# Altium schematic sheet SCH15.SchDoc
size 381 x 241 mm; SheetNumber: 1; SheetTotal: 1
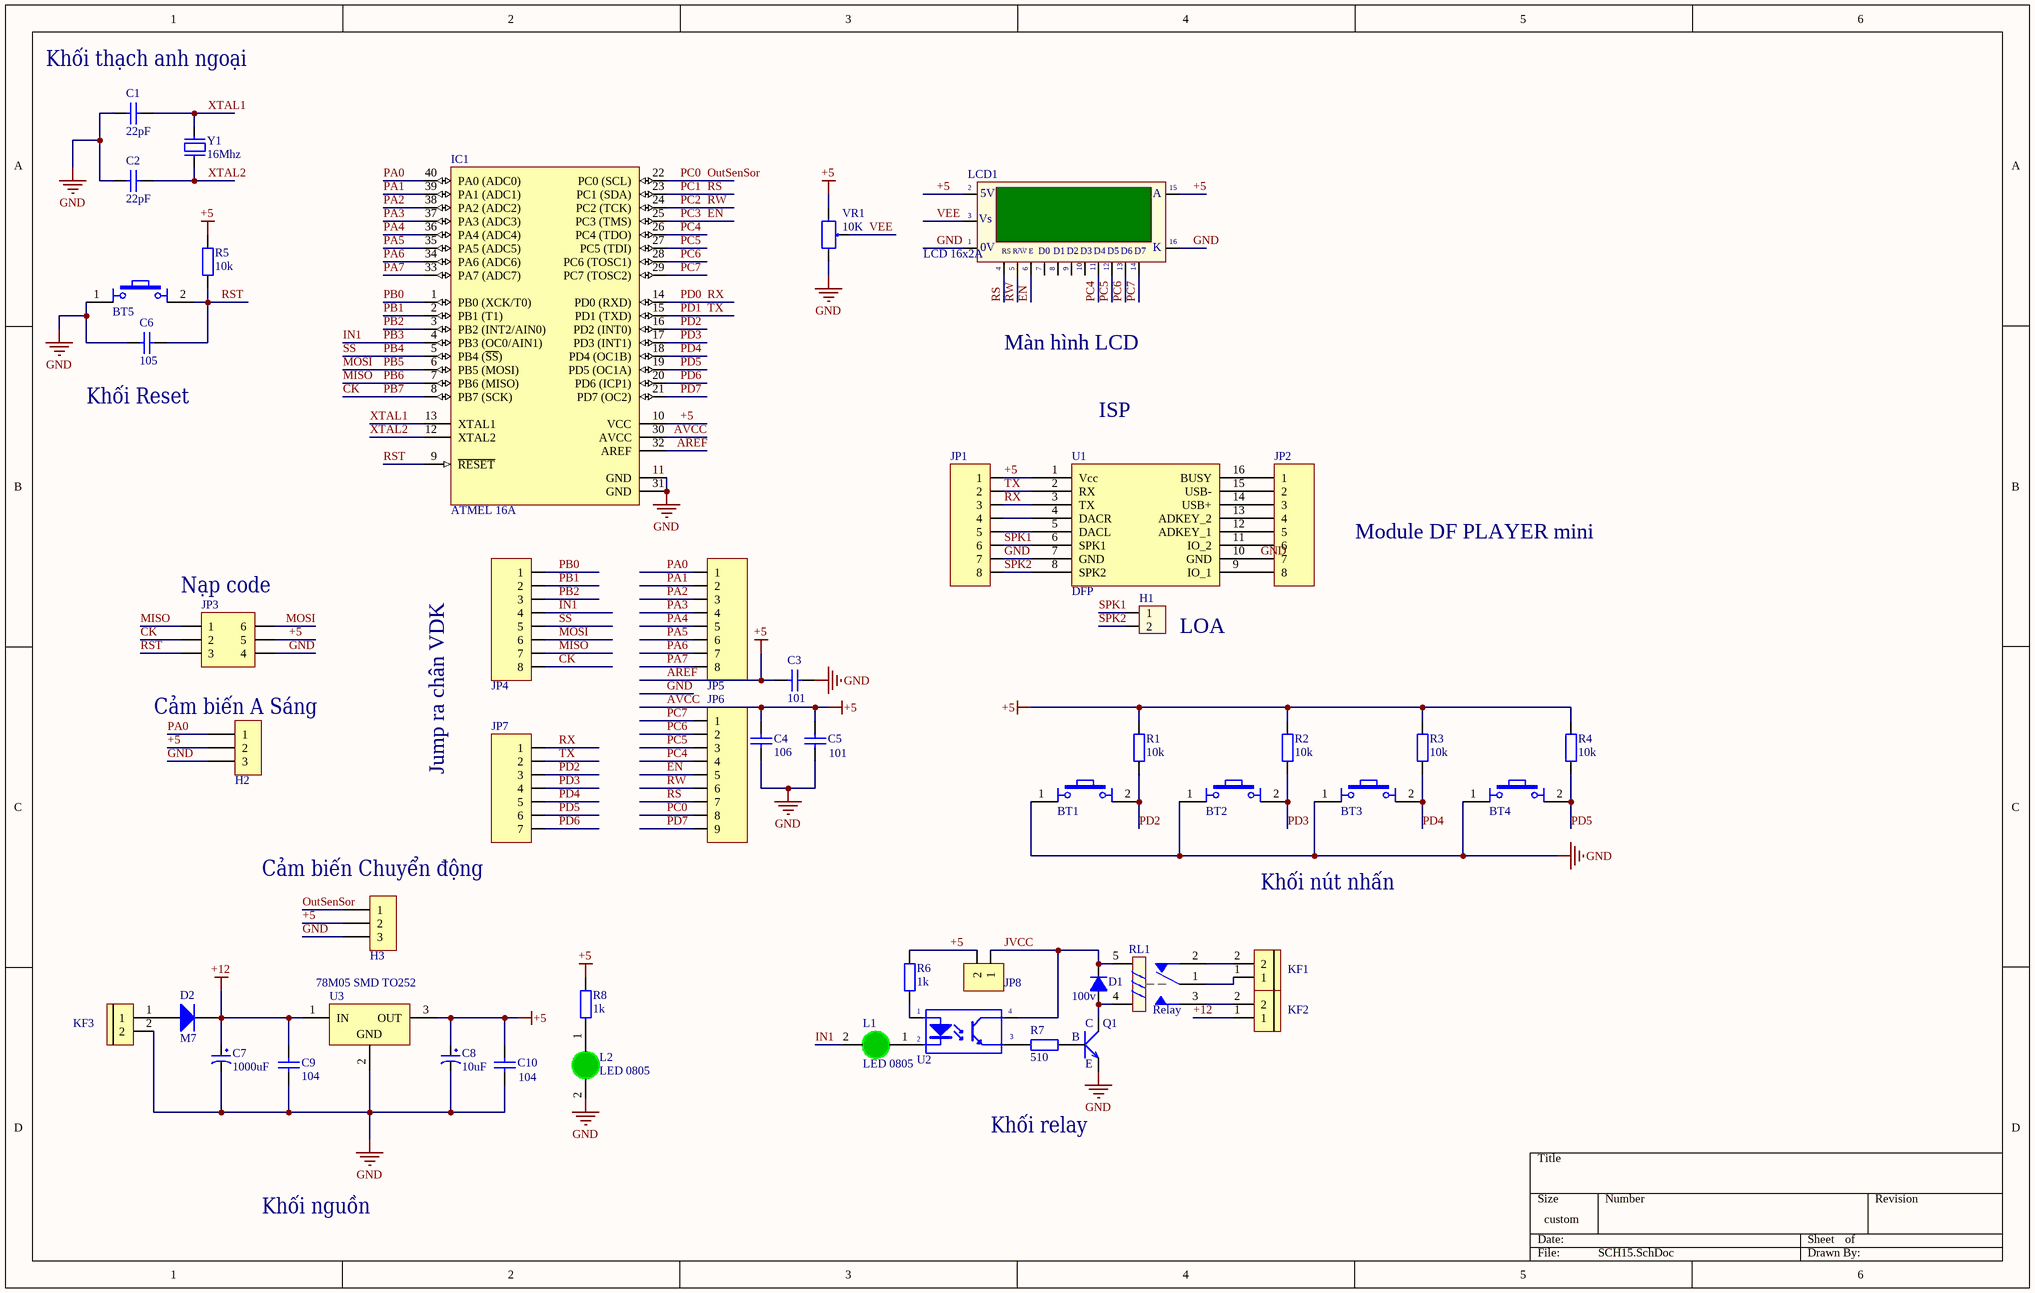
[diagram p0: SCH15.SchDoc]

## Parts
BT1  Nut Nhan 4 Chan Cam 6x6  [Nut Nhan 4 Chan Cam 6x6]  (value not drawn)
BT2  Nut Nhan 4 Chan Cam 6x6  [Nut Nhan 4 Chan Cam 6x6]  (value not drawn)
BT3  Nut Nhan 4 Chan Cam 6x6  [Nut Nhan 4 Chan Cam 6x6]  (value not drawn)
BT4  Nut Nhan 4 Chan Cam 6x6  [Nut Nhan 4 Chan Cam 6x6]  (value not drawn)
BT5  Nut Nhan 4 Chan Cam 6x6  [Nut Nhan 4 Chan Cam 6x6]  (value not drawn)
C1  22pF  [tu 0805]
C2  22pF  [tu 0805]
C3  101  [tu 0805]
C4  106  [tu 0805]
C5  101  [tu 0805]
C6  105  [tu 0805]
C7  1000uF  [tu hoa 8mm]
C8  10uF  [tu hoa 4mm]
C9  104  [tu 0805]
C10  104  [tu 0805]
D1  100v  [DIODE ZENNER SMD SOD80]
D2  M7  [DIODE SMA]
H1  Header 2P 2.54 Duc Thang  [XH2.54M-2]  (value not drawn)
H2  Header 3P 2.54 Duc Thang  [XH2.54M-3]  (value not drawn)
H3  Header 3P 2.54 Duc Thang  [XH2.54M-3]  (value not drawn)
IC1  ATMEL 16A  [DIP40/W0.6]
JP1  JP 1x8 2.54  [JP 1x8 DT]  (value not drawn)
JP2  JP 1x8 2.54  [JP 1x8 DT]  (value not drawn)
JP3  JP 2x3 2.54  [JP 2x3 DT]  (value not drawn)
JP4  JP 1x8 2.54  [JP 1x8 DT]  (value not drawn)
JP5  JP 1x8 2.54  [JP 1x8 DT]  (value not drawn)
JP6  JP 1x9 2.54  [JP 1x9 DT]  (value not drawn)
JP7  JP 1x7 2.54  [JP 1x7 DT]  (value not drawn)
JP8  JP 1x2 2.54  [JP 1x2 DT]  (value not drawn)
KF1  CON 2 KF301  [Con 2 KF301 5.08]  (value not drawn)
KF2  CON 2 KF301  [Con 2 KF301 5.08]  (value not drawn)
KF3  CON 2 KF301  [Con 2 KF301 5.08]  (value not drawn)
L1  LED 0805  [LED-0805-Green]
L2  LED 0805  [LED-0805-Green]
LCD1  LCD 16x2A  [LCD16X2N]
Q1  SMD-TRANSISTORS-NPN-25V-500MW(SOT-23)  [SOT 23-3]  (value not drawn)
R1  10k  [tro smd 0805]
R2  10k  [tro smd 0805]
R3  10k  [tro smd 0805]
R4  10k  [tro smd 0805]
R5  10k  [tro smd 0805]
R6  1k  [tro smd 0805]
R7  510  [tro smd 0805]
R8  1k  [tro smd 0805]
RL1  Relay  [Relay 5 Chan SRD]
U1  DFP  [DFPlayer]
U2  OPTO PC817 DIP4  [DIP4]  (value not drawn)
U3  78M05 SMD TO252  [TO252]
VR1  10K  [Bien Tro Vi Chinh Dung]
Y1  16Mhz  [Thach Anh 2 chan cam]

## Nets
+5: C3.1 C4.2 C5.1 C8.1 C10.1 H2.2 H3.2 IC1.10(VCC) IC1.30(AVCC) IC1.32(AREF) JP1.1 JP3.5 JP8.2 LCD1.2(VDD) LCD1.15(A) R1.2 R2.2 R3.2 R4.2 R5.2 R6.1 R8.2 U1.1(Vcc) U3.3(OUT) VR1.1  [also labelled AREF, AVCC]
+12: C7.1 C9.1 D2.2(K) KF2.1 U3.1(IN)
GND: BT1.1 BT2.1 BT3.1 BT4.1 BT5.1 C1.2 C2.2 C3.2 C4.1 C5.2 C6.1 C7.2 C8.2 C9.2 C10.2 H2.3 H3.3 IC1.11(GND) IC1.31(GND) JP1.7 JP2.7 JP3.4 KF3.2 L2.2(K) LCD1.1(GND) LCD1.16(K) Q1.2(E) U1.7(GND) U1.10(GND) U3.2(GND) VR1.3
CK: IC1.8(PB7_(SCK)) JP3.2 JP4.8  [also labelled PB7]
EN: IC1.25(PC3_(TMS)) JP6.5 LCD1.6(~{EN})  [also labelled PC3]
IN1: IC1.4(PB3_(OC0/AIN1)) JP4.4 L1.2(K)  [also labelled PB3]
JVCC: D1.2(K) JP8.1 RL1.5 U2.4(C)
MISO: IC1.7(PB6_(MISO)) JP3.1 JP4.7  [also labelled PB6]
MOSI: IC1.6(PB5_(MOSI)) JP3.6 JP4.6  [also labelled PB5]
OutSenSor: H3.1 IC1.22(PC0_(SCL)) JP6.8  [also labelled PC0]
PA0: H2.1 IC1.40(PA0_(ADC0)) JP5.1
PA1: IC1.39(PA1_(ADC1)) JP5.2
PA2: IC1.38(PA2_(ADC2)) JP5.3
PA3: IC1.37(PA3_(ADC3)) JP5.4
PA4: IC1.36(PA4_(ADC4)) JP5.5
PA5: IC1.35(PA5_(ADC5)) JP5.6
PA6: IC1.34(PA6_(ADC6)) JP5.7
PA7: IC1.33(PA7_(ADC7)) JP5.8
PB0: IC1.1(PB0_(XCK/T0)) JP4.1
PB1: IC1.2(PB1_(T1)) JP4.2
PB2: IC1.3(PB2_(INT2/AIN0)) JP4.3
PB4: IC1.5(PB4_(~{SS})) JP4.5  [also labelled SS]
PC1: IC1.23(PC1_(SDA)) JP6.7 LCD1.4(RS)  [also labelled RS]
PC2: IC1.24(PC2_(TCK)) JP6.6 LCD1.5(R/~{W})  [also labelled RW]
PC4: IC1.26(PC4_(TDO)) JP6.4 LCD1.11(D4)
PC5: IC1.27(PC5_(TDI)) JP6.3 LCD1.12(D5)
PC6: IC1.28(PC6_(TOSC1)) JP6.2 LCD1.13(D6)
PC7: IC1.29(PC7_(TOSC2)) JP6.1 LCD1.14(D7)
PD0: IC1.14(PD0_(RXD)) JP1.3 JP7.1 U1.3(TX)  [also labelled RX]
PD1: IC1.15(PD1_(TXD)) JP1.2 JP7.2 U1.2(RX)  [also labelled TX]
PD2: BT1.2 IC1.16(PD2_(INT0)) JP7.3 R1.1
PD3: BT2.2 IC1.17(PD3_(INT1)) JP7.4 R2.1
PD4: BT3.2 IC1.18(PD4_(OC1B)) JP7.5 R3.1
PD5: BT4.2 IC1.19(PD5_(OC1A)) JP7.6 R4.1
PD6: IC1.20(PD6_(ICP1)) JP7.7
PD7: IC1.21(PD7_(OC2)) JP6.9
RST: BT5.2 C6.2 IC1.9(~{RESET}) JP3.3 R5.1
SPK1: H1.1 JP1.6 U1.6(SPK1)
SPK2: H1.2 JP1.8 U1.8(SPK2)
VEE: LCD1.3(VEE) VR1.2
XTAL1: C1.1 IC1.13(XTAL1) Y1.2
XTAL2: C2.1 IC1.12(XTAL2) Y1.1
NetD1_1: D1.1(A) Q1.3(C) RL1.4
NetD2_1: D2.1(A) KF3.1
NetJP1_4: JP1.4 U1.4(DACR)
NetJP1_5: JP1.5 U1.5(DACL)
NetJP2_1: JP2.1 U1.16(BUSY)
NetJP2_2: JP2.2 U1.15(USB-)
NetJP2_3: JP2.3 U1.14(USB+)
NetJP2_4: JP2.4 U1.13(ADKEY_2)
NetJP2_5: JP2.5 U1.12(ADKEY_1)
NetJP2_6: JP2.6 U1.11(IO_2)
NetJP2_8: JP2.8 U1.9(IO_1)
NetKF1_1: KF1.1 RL1.1
NetKF1_2: KF1.2 RL1.2
NetKF2_2: KF2.2 RL1.3
NetL1_1: L1.1(A) U2.2(K)
NetL2_1: L2.1(A) R8.1
NetQ1_1: Q1.1(B) R7.1
NetR6_2: R6.2 U2.1(A)
NetR7_2: R7.2 U2.3(E)

Not connected (* = marked no-connect by the designer): LCD1 7(D0) 8(D1) 9(D2) 10(D3)

## Notes on the sheet
- (near C1) Khối thạch anh ngoại
- Màn hình LCD
- (near C6) Khối Reset
- ISP
- Module DF PLAYER mini
- (near JP3) Nạp code
- LOA
- (near H2) Cảm biến A Sáng
- Jump ra chân VDK
- (near H3) Cảm biến Chuyển động
- Khối nút nhấn
- Khối relay
- Khối nguồn
- (in symbol LCD16x2A) 5V; Vs; |; 0V; R/W; E

## Library data of the parts
BT1-BT5 = Nut Nhan 4 Chan Cam 6x6: Nut Nhan 4 Chan 6x6mm; Ten: Nút Nhấn 4 Chân 6x6x5MM DIP; Ma_Hang: MH004584
C1 C2 = Tu 0805 22pF 50V 10%: Dán; Don_Vi: Con; So_Chan: 2; Ten_Linh_Kien: Tụ 0805 22P 10% 50V; Ma_Hang: MH004560; Chung_Loai: Dán; Kieu_Chan: *
C3 C5 = Tu 0805 101 50V 20%: Dán; Don_Vi: Con; So_Chan: 2; Ten_Linh_Kien: Tụ 0805 101-0.1nF 50V 20%; Ma_Hang: MH002806; Chung_Loai: Dán; Kieu_Chan: *
C4 = Tu 0805 106 16V 10%: Dán; Ten_Linh_Kien: Tụ 0805 106-10uF 10% 16V; So_Chan: 2; Don_Vi: Con; Ma_Hang: MH004553; Chung_Loai: Dán; Kieu_Chan: *
C6 = Tu 0805 105 50V 10%: Dán; Don_Vi: Con; So_Chan: 2; Ten_Linh_Kien: Tụ 0805 105-1uF 10% 50V; Ma_Hang: MH004552; Chung_Loai: Dán; Kieu_Chan: *
C7 = Tu Hoa 1000uF 16V 8x20: Cắm; Don_Vi: Con; So_Chan: 2; Ten_Linh_Kien: Tụ Hóa 1000uF 16V 8x20MM; Ma_Hang: MH008300; Chung_Loai: Cắm; Kieu_Chan: *
C8 = Tu Hoa 10uF 16V 4x7: Cắm; So_Chan: 2; Don_Vi: Con; Ten_Linh_Kien: Tụ Hóa 10uF 16V; Ma_Hang: MH006855; Chung_Loai: Cắm; Kieu_Chan: *
C9 C10 = Tu 0805 104 50V 10%: Dán; Don_Vi: Con; So_Chan: 2; Ten_Linh_Kien: Tụ 0805 104-100nF 10% 50V; Ma_Hang: MH004551; Chung_Loai: Dán; Kieu_Chan: *
D1 = Diode 1N4148: Cắm; Ten_Linh_Kien: Diode 1N4148 DO35 450mA 100V ( 1N4148 DIP); Don_Vi: Con; Ma_Hang: MH001065; Ghi Chu: *; Kieu_Chan: *; Chung_Loai: Cắm
D2 = Diode M7 ( 4007 ): Dán; Don_Vi: Con; Ten_Linh_Kien: Diode M7 1N4007 SMD 1A 1000V; Ma_Hang: MH000944; Chung_Loai: Dán; Ghi_Chu: *
H1 = Header 2P 2.54 Duc Thang: Cắm; Ten_Linh_Kien: Header 2P XH2.54-2P Đực Thẳng; Don_Vi: Con; Ma_Hang: MH001283; Chung_Loai: Cắm
H2 H3 = Header 3P 2.54 Duc Thang: Cắm; Ten_Linh_Kien: Header 3P XH2.54-3P Đực Thẳng; Don_Vi: Con; Ma_Hang: MH001292; Chung_Loai: Cắm
IC1 = ATmega16A-PU: 8-Bit AVR Microcontroller with 16K Bytes of In-System Programmable Flash Memory; Value: Atmega 16L
JP1 JP2 JP4 JP5 = JP 1x8 2.54 Duc Thang: Cắm; Ten_Linh_Kien: Jump Đơn Đực 2.54MM 1x40P Thẳng 11MM; Don_Vi: Con; Ma_Hang: MH000903; Ghi_Chu: *; Kieu_Chan: *; Chung_Loai: Cắm
JP3 = JP 2x3 2.54 Duc Thang: Cắm; Ten_Linh_Kien: Jump Đôi Đực 2.54MM 2x40P Thẳng 11MM; Don_Vi: Con; Ma_Hang: MH002686; Ghi_Chu: *; Kieu_Chan: *; Chung_Loai: Cắm
JP6 = JP 1x9 2.54 Duc Thang: Cắm; Ten_Linh_Kien: Jump Đơn Đực 2.54MM 1x40P Thẳng 11MM; Don_Vi: Con; Ma_Hang: MH000903; Ghi_Chu: *; Kieu_Chan: *; Chung_Loai: Cắm
JP7 = JP 1x7 2.54 Duc Thang: Cắm; Ten_Linh_Kien: Jump Đơn Đực 2.54MM 1x40P Thẳng 11MM; Don_Vi: Con; Ma_Hang: MH000903; Ghi_Chu: *; Kieu_Chan: *; Chung_Loai: Cắm
JP8 = JP 1x2 2.54 Duc Thang: Cắm; Ten_Linh_Kien: Jump Đơn Đực 2.54MM 1x40P Thẳng 11MM; Don_Vi: Con; Ma_Hang: MH000903; Ghi_Chu: *; Kieu_Chan: *; Chung_Loai: Cắm
KF1-KF3 = CON 2 KF301: Cắm; Ma_Hang: MH000987; Ten_Linh_Kien: CON 2 KF301-2P 5.08MM Xanh Dương; Chung_Loai: Cắm; Ghi_Chu: *; Kieu_Chan: *; Don_Vi: Con
L1 L2 = LED 0805 Xanh La: Dán; Don_Vi: Con; Ma_Hang: MH002326; Ten_Linh_Kien: LED 0805 Màu Xanh Lá (Green); Ghi_Chu: *; Kieu_Chan: *; Chung_Loai: Dán
LCD1 = LCD16x2A: LCD dipslay 16 char, 2 line; Value: LCD16x2A
Q1 = SMD-TRANSISTORS-NPN-25V-500MW(SOT-23): Bipolar (BJT) Transistor NPN 25 V 500 mA 150MHz 300 mW Surface Mount SOT-23; MF: UMW; MP: S8050; Purchase-URL: https://pricing.snapeda.com/search/part/S8050/?ref=eda; Check_prices: https://www.snapeda.com/parts/S8050/Umwelt+Sensor+Teknik/view-part/?ref=eda; SnapEDA_Link: https://www.snapeda.com/parts/S8050/Umwelt+Sensor+Teknik/view-part/?ref=snap; Price: None; Availability: In Stock; Package: None; Value: *
R1-R5 = Tro 0805 1% 10k: Dán; Don_Vi: Con; So_Chan: 2; Ten_Linh_Kien: Trở 0805 1% 10k; Ma_Hang: MH005473; Chung_Loai: Dán; Kieu_Chan: *
R6-R8 = Tro 0805 1% 1k: Dán; Don_Vi: Con; So_Chan: 2; Ten_Linh_Kien: Trở 0805 1% 1k; Ma_Hang: MH005468; Chung_Loai: Dán; Kieu_Chan: *
RL1 = Relay 5 Chan SRD: Relay 5 Chan; Ma_Hang: MH009374; Ten: Relay 5V10A SRD-05VDC-SL-C Chính Hãng
U1 = DFPlayer
U2 = OPTO PC817 DIP4: Single Opto; Value: PC817
U3 = 78M05 SMD TO252: Dán; Don_Vi: Con; Ten_Linh_Kien: 78M05 TO252; Ma_Hang: MH001917; Ghi_Chu: *; Kieu_Chan: *; Chung_Loai: Dán
VR1 = Bien Tro Tinh Chinh 1K Dung: Cắm; Don_Vi: Con; Ten_Linh_Kien: Biến Trở VR 102-1K 3296W; Ma_Hang: MH003234; Kieu_Chan: *; Chung_Loai: Cắm
Y1 = Thach Anh 2 chan Cam: Crystal For all Crystal 2pin.; Value: 4Mhz